# Altium schematic sheet key_count.SchDoc
size A4
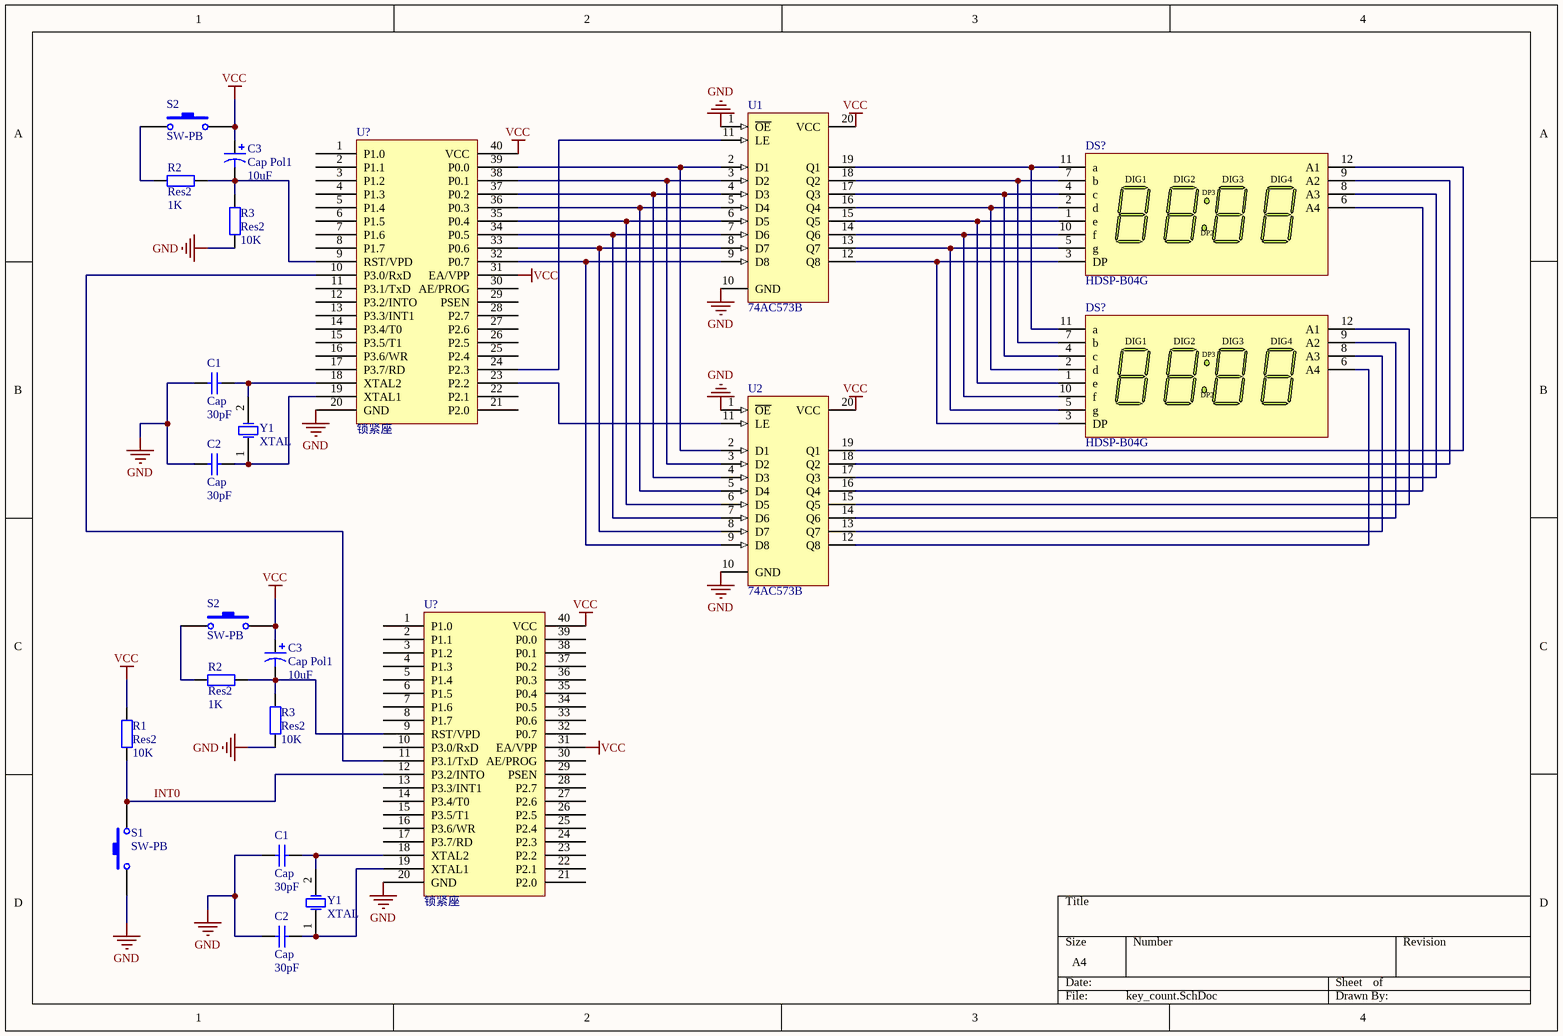
[diagram p0: key_count.SchDoc]

## Parts
(Parts that share a designator on the sheet are numbered #1, #2 ... from top to bottom, then left to right.)
C1#1  Cap  value 30pF  [RAD-0.3]
C1#2  Cap  value 30pF  [RAD-0.3]
C2#1  Cap  value 30pF  [RAD-0.3]
C2#2  Cap  value 30pF  [RAD-0.3]
C3#1  Cap Pol1  value 10uF  [RB7.6-15]
C3#2  Cap Pol1  value 10uF  [RB7.6-15]
DS?#1  HDSP-B04G  [B-88]
DS?#2  HDSP-B04G  [B-88]
R1  Res2  value 10K  [AXIAL-0.4]
R2#1  Res2  value 1K  [AXIAL-0.4]
R2#2  Res2  value 1K  [AXIAL-0.4]
R3#1  Res2  value 10K  [AXIAL-0.4]
R3#2  Res2  value 10K  [AXIAL-0.4]
S1  SW-PB  [SPST-2]
S2#1  SW-PB  [SPST-2]
S2#2  SW-PB  [SPST-2]
U1  74AC573B  [DIP20]
U2  74AC573B  [DIP20]
U?#1  锁紧座  [DIP_TP40-600]
U?#2  锁紧座  [DIP_TP40-600]
Y1#1  XTAL  [R38]
Y1#2  XTAL  [R38]

## Nets
GND: C1#1.1 C1#2.1 C2#1.1 C2#2.1 R3#1.1 R3#2.1 S1.1 U1.1(~{OE}) U1.10(GND) U2.1(~{OE}) U2.10(GND) U?#1.20(GND) U?#2.20(GND)
VCC: C3#1.1 C3#2.1 R1.2 S2#1.2 S2#2.2 U1.20(VCC) U2.20(VCC) U?#1.31(EA/VPP) U?#1.40(VCC) U?#2.31(EA/VPP) U?#2.40(VCC)
INT0: R1.1 S1.2 U?#2.12(P3.2/INTO)
NetC1#1_2: C1#1.2 U?#1.18(XTAL2) Y1#1.2(OSC2)
NetC1#2_2: C1#2.2 U?#2.18(XTAL2) Y1#2.2(OSC2)
NetC2#1_2: C2#1.2 U?#1.19(XTAL1) Y1#1.1(OSC1)
NetC2#2_2: C2#2.2 U?#2.19(XTAL1) Y1#2.1(OSC1)
NetC3#1_2: C3#1.2 R2#1.2 R3#1.2 U?#1.9(RST/VPD)
NetC3#2_2: C3#2.2 R2#2.2 R3#2.2 U?#2.9(RST/VPD)
NetDS?#1_1: DS?#1.1(e) DS?#2.1(e) U1.15(Q5)
NetDS?#1_2: DS?#1.2(d) DS?#2.2(d) U1.16(Q4)
NetDS?#1_3: DS?#1.3(DP) DS?#2.3(DP) U1.12(Q8)
NetDS?#1_4: DS?#1.4(c) DS?#2.4(c) U1.17(Q3)
NetDS?#1_5: DS?#1.5(g) DS?#2.5(g) U1.13(Q7)
NetDS?#1_6: DS?#1.6(A4) U2.16(Q4)
NetDS?#1_7: DS?#1.7(b) DS?#2.7(b) U1.18(Q2)
NetDS?#1_8: DS?#1.8(A3) U2.17(Q3)
NetDS?#1_9: DS?#1.9(A2) U2.18(Q2)
NetDS?#1_10: DS?#1.10(f) DS?#2.10(f) U1.14(Q6)
NetDS?#1_11: DS?#1.11(a) DS?#2.11(a) U1.19(Q1)
NetDS?#1_12: DS?#1.12(A1) U2.19(Q1)
NetDS?#2_6: DS?#2.6(A4) U2.12(Q8)
NetDS?#2_8: DS?#2.8(A3) U2.13(Q7)
NetDS?#2_9: DS?#2.9(A2) U2.14(Q6)
NetDS?#2_12: DS?#2.12(A1) U2.15(Q5)
NetR2#1_1: R2#1.1 S2#1.1
NetR2#2_1: R2#2.1 S2#2.1
NetU1_2: U1.2(D1) U2.2(D1) U?#1.39(P0.0)
NetU1_3: U1.3(D2) U2.3(D2) U?#1.38(P0.1)
NetU1_4: U1.4(D3) U2.4(D3) U?#1.37(P0.2)
NetU1_5: U1.5(D4) U2.5(D4) U?#1.36(P0.3)
NetU1_6: U1.6(D5) U2.6(D5) U?#1.35(P0.4)
NetU1_7: U1.7(D6) U2.7(D6) U?#1.34(P0.5)
NetU1_8: U1.8(D7) U2.8(D7) U?#1.33(P0.6)
NetU1_9: U1.9(D8) U2.9(D8) U?#1.32(P0.7)
NetU1_11: U1.11(LE) U?#1.24(P2.3)
NetU2_11: U2.11(LE) U?#1.23(P2.2)
NetU?#1_10: U?#1.10(P3.0/RxD) U?#2.11(P3.1/TxD)

Not connected (* = marked no-connect by the designer): U?#1 1(P1.0) 2(P1.1) 3(P1.2) 4(P1.3) 5(P1.4) 6(P1.5) 7(P1.6) 8(P1.7) 11(P3.1/TxD) 12(P3.2/INTO) 13(P3.3/INT1) 14(P3.4/T0) 15(P3.5/T1) 16(P3.6/WR) 17(P3.7/RD) 21(P2.0) 22(P2.1) 25(P2.4) 26(P2.5) 27(P2.6) 28(P2.7) 29(PSEN) 30(AE/PROG); U?#2 1(P1.0) 2(P1.1) 3(P1.2) 4(P1.3) 5(P1.4) 6(P1.5) 7(P1.6) 8(P1.7) 10(P3.0/RxD) 13(P3.3/INT1) 14(P3.4/T0) 15(P3.5/T1) 16(P3.6/WR) 17(P3.7/RD) 21(P2.0) 22(P2.1) 23(P2.2) 24(P2.3) 25(P2.4) 26(P2.5) 27(P2.6) 28(P2.7) 29(PSEN) 30(AE/PROG) 32(P0.7) 33(P0.6) 34(P0.5) 35(P0.4) 36(P0.3) 37(P0.2) 38(P0.1) 39(P0.0)

## Notes on the sheet
- (in symbol HDSP-B04G) DIG1; DIG2; DIG3; DIG4; DP3; DP2

## Library data of the parts
C1#1 C1#2 C2#1 C2#2 = Cap: Capacitor; Published: 8-Jun-2000; LatestRevisionDate: 17-Jul-2002; LatestRevisionNote: Re-released for DXP Platform.; PackageReference: RAD-0.3; Publisher: Altium Limited; PackageDescription: Radial Cap, Thru-Hole; 2 Leads; 0.3 in Pin Spacing
C3#1 C3#2 = Cap Pol1: Polarized Capacitor (Radial); Published: 8-Jun-2000; LatestRevisionDate: 17-Jul-2002; LatestRevisionNote: Re-released for DXP Platform.; PackageReference: RB7.6-15; Publisher: Altium Limited; PackageDescription: Polarized Capacitor (Radial); 2 Leads
DS?#1 DS?#2 = HDSP-B04G: 14.22 mm Tinted Green, 88:88 4-Digit 7-Segment Display: CA, Gray Surface; LuminousIntensity: 2000 ucd (Minimum).; Published: 26-May-2004; LatestRevisionDate: 11-Oct-2004; LatestRevisionNote: Display outline superimposed on PCB Footprint.; DatasheetVersion: 23-Sep-2002; PackageVersion: 21-Aug-2001; PackageReference: B-88; Publisher: Altium Limited; PackageDescription: LED, 7-Segment Display, 14.22 mm, Four Digit, 88:88; 12 Leads; Row Space 15.24 mm; Pitch 2.54 mm; LED_Colour: Green; ComponentLink1Description: Manufacturer Link; ComponentLink1URL: http://www.agilent.com/; ComponentLink2Description: Datasheet; ComponentLink2URL: http://cp.literature.agilent.com/litweb/pdf/5988-7859EN.pdf
R1 R2#1 R2#2 R3#1 R3#2 = Res2: Resistor; Published: 8-Jun-2000; LatestRevisionDate: 17-Jul-2002; LatestRevisionNote: Re-released for DXP Platform.; PackageReference: AXIAL-0.4; Publisher: Altium Limited; PackageDescription: Axial Device, Thru-Hole; 2 Leads; 0.4 in Pin Spacing
S1 S2#1 S2#2 = SW-PB: Switch; Published: 24-Mar-1999; LatestRevisionDate: 17-Jul-2002; LatestRevisionNote: Re-released for DXP Platform.; PackageReference: SPST-2; Publisher: Altium Limited; PackageDescription: Switch; 2 Leads
U1 U2 = 74AC573B: Octal D-Type Latch with 3-State Output Non-Inverting; Published: 8-Jun-2000; LatestRevisionDate: 06-Jun-2005; LatestRevisionNote: Stylized 3D Model Added.; DatasheetVersion: Apr-1997; PackageVersion: Jun-1998; PackageReference: DIP20; Publisher: Altium Limited; PackageDescription: DIP; 20 Leads; Row Spacing 7.62 mm; Pitch 2.54 mm; Code_JEDEC: MS-015-AE; ComponentLink1Description: Manufacturer Link; ComponentLink1URL: http://www.st.com/; ComponentLink2Description: Datasheet; ComponentLink2URL: http://www.st.com/stonline/products/literature/ds/4702/74ac573.pdf
U?#1 U?#2 = STC89C52
Y1#1 Y1#2 = XTAL: Crystal Oscillator; Published: 8-Jun-2000; LatestRevisionDate: 17-Jul-2002; LatestRevisionNote: Re-released for DXP Platform.; PackageReference: R38; Publisher: Altium Limited; PackageDescription: Crystal, Thru-Hole; 2 Leads; Body 3.1 x 8.2 mm (Dia.xH)